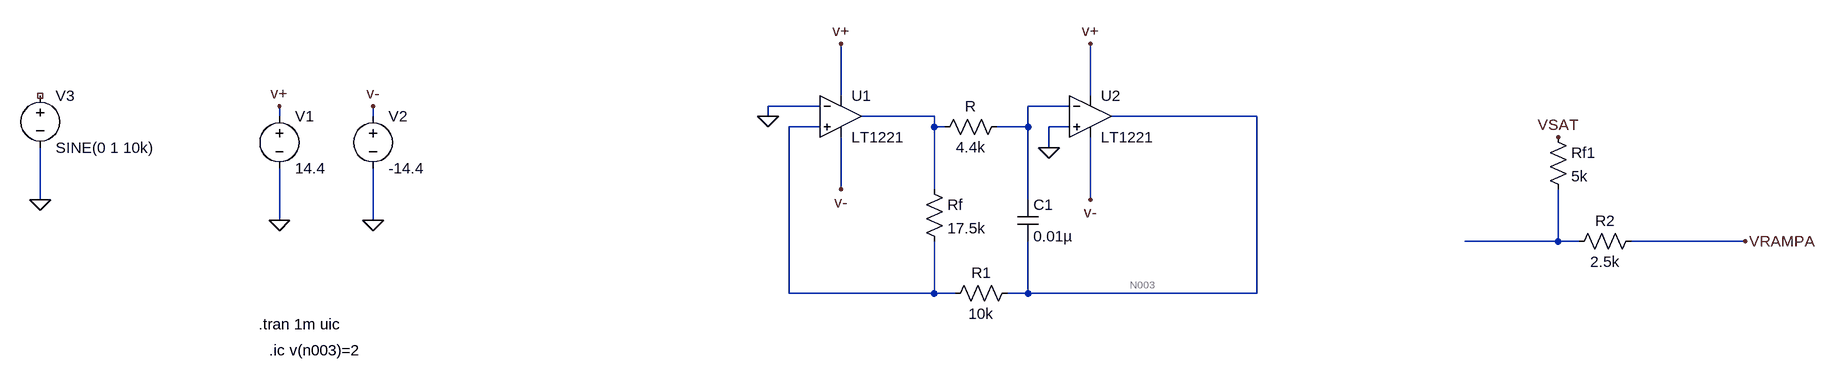
[diagram p0: schematic ejercicioparcial(cuadradatriangular).asc]
ejercicioparcial(cuadradatriangular).asc, the LTspice schematic file:
Version 4
SHEET 1 1640 680
WIRE 128 176 128 96
WIRE 512 176 512 96
WIRE 96 192 16 192
WIRE 480 192 416 192
WIRE -736 208 -736 192
WIRE -592 208 -592 192
WIRE 16 208 16 192
WIRE 272 208 160 208
WIRE 768 208 544 208
WIRE 96 224 48 224
WIRE 272 224 272 208
WIRE 288 224 272 224
WIRE 416 224 416 192
WIRE 416 224 368 224
WIRE 480 224 448 224
WIRE 448 256 448 224
WIRE 128 320 128 240
WIRE 272 320 272 224
WIRE -1104 336 -1104 256
WIRE 416 336 416 224
WIRE 512 336 512 240
WIRE -736 368 -736 288
WIRE -592 368 -592 288
WIRE 1232 400 1232 320
WIRE 1232 400 1088 400
WIRE 1264 400 1232 400
WIRE 1520 400 1344 400
WIRE 48 480 48 224
WIRE 272 480 272 400
WIRE 272 480 48 480
WIRE 304 480 272 480
WIRE 416 480 416 400
WIRE 416 480 384 480
WIRE 768 480 768 208
WIRE 768 480 416 480
FLAG -736 368 0
FLAG -592 368 0
FLAG -736 192 v+
FLAG 128 96 v+
FLAG 512 96 v+
FLAG -592 192 v-
FLAG 128 320 v-
FLAG 512 336 v-
FLAG 16 208 0
FLAG 448 256 0
FLAG 1232 240 VSAT
FLAG 1520 400 VRAMPA
FLAG -1104 336 0
SYMBOL res 256 304 R0
SYMATTR InstName Rf
SYMATTR Value 17.5k
SYMBOL res 384 208 R90
WINDOW 0 0 56 VBottom 2
WINDOW 3 32 56 VTop 2
SYMATTR InstName R
SYMATTR Value 4.4k
SYMBOL res 400 464 R90
WINDOW 0 0 56 VBottom 2
WINDOW 3 32 56 VTop 2
SYMATTR InstName R1
SYMATTR Value 10k
SYMBOL voltage -736 192 R0
WINDOW 123 0 0 Left 0
WINDOW 39 0 0 Left 0
SYMATTR InstName V1
SYMATTR Value 14.4
SYMBOL voltage -592 192 R0
WINDOW 123 0 0 Left 0
WINDOW 39 0 0 Left 0
SYMATTR InstName V2
SYMATTR Value -14.4
SYMBOL cap 400 336 R0
SYMATTR InstName C1
SYMATTR Value 0.01µ
SYMBOL Opamps\\LT1221 128 144 R0
SYMATTR InstName U1
SYMBOL Opamps\\LT1221 512 144 R0
SYMATTR InstName U2
SYMBOL res 1216 224 R0
SYMATTR InstName Rf1
SYMATTR Value 5k
SYMBOL res 1360 384 R90
WINDOW 0 0 56 VBottom 2
WINDOW 3 32 56 VTop 2
SYMATTR InstName R2
SYMATTR Value 2.5k
SYMBOL voltage -1104 160 R0
WINDOW 123 0 0 Left 0
WINDOW 39 0 0 Left 0
SYMATTR InstName V3
SYMATTR Value SINE(0 1 10k)
TEXT -768 528 Left 2 !.tran 1m uic
TEXT -752 568 Left 2 !.ic v(n003)=2

The netlist it stands for:
* ejercicioparcial(cuadradatriangular).asc
Rf N002 N004 17.5k
R N001 N002 4.4k
R1 N003 N004 10k
V1 v+ 0 14.4
V2 v- 0 -14.4
C1 N001 N003 0.01µ
XU1 N004 0 v+ v- N002 LT1221  ; pins In+ In- V+ V- OUT
XU2 0 N001 v+ v- N003 LT1221  ; pins In+ In- V+ V- OUT
Rf1 VSAT N005 5k
R2 VRAMPA N005 2.5k
V3 NC_01 0 SINE(0 1 10k)
.tran 1m uic
.ic v(n003)=2
.backanno
.end